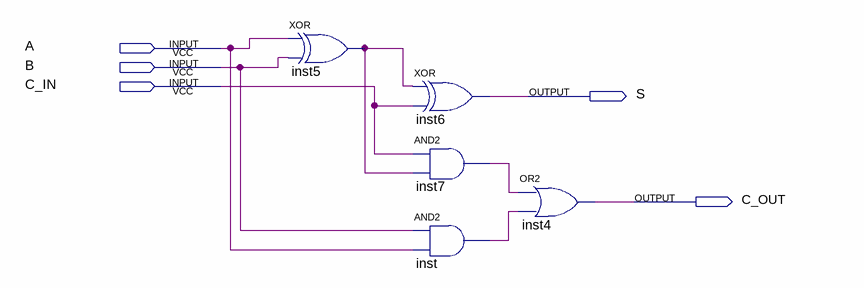
[diagram p0: schematic sheet]
// Quartus schematic FAx1.bdf as structural Verilog: 5 symbols, 5 pins
module FAx1 (
  input  A,
  input  B,
  input  C_IN,
  output S,
  output C_OUT
);

  wire inst5_out, inst7_out, inst_out;

  xor inst5 (inst5_out, A, B);
  xor inst6 (S, inst5_out, C_IN);
  and inst7 (inst7_out, C_IN, inst5_out);
  and inst (inst_out, B, A);
  or inst4 (C_OUT, inst7_out, inst_out);
endmodule
